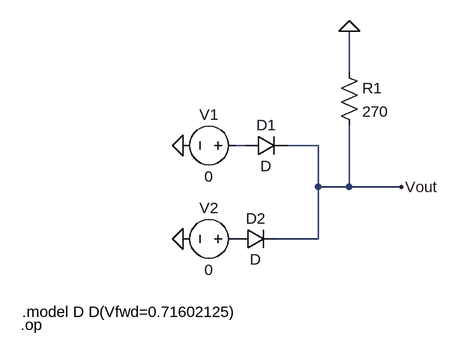
[diagram p0: schematic D3-DÇ4.asc]
D3-DÇ4.asc, the LTspice schematic file:
Version 4
SHEET 1 880 680
WIRE 288 -16 288 -80
WIRE 128 96 112 96
WIRE 240 96 192 96
WIRE 240 160 240 96
WIRE 288 160 288 64
WIRE 288 160 240 160
WIRE 368 160 288 160
WIRE 240 240 240 160
WIRE 240 240 176 240
FLAG 368 160 Vout
FLAG 32 96 0
FLAG 32 240 0
FLAG 288 -80 0
SYMBOL res 272 -32 R0
SYMATTR InstName R1
SYMATTR Value 270
SYMBOL voltage 128 96 R90
WINDOW 0 -32 56 VBottom 2
WINDOW 3 32 56 VTop 2
WINDOW 123 0 0 Left 0
WINDOW 39 0 0 Left 0
SYMATTR InstName V1
SYMATTR Value 0
SYMBOL voltage 128 240 R90
WINDOW 0 -32 56 VBottom 2
WINDOW 3 32 56 VTop 2
WINDOW 123 0 0 Left 0
WINDOW 39 0 0 Left 0
SYMATTR InstName V2
SYMATTR Value 0
SYMBOL diode 128 112 R270
WINDOW 0 32 32 VTop 2
WINDOW 3 0 32 VBottom 2
SYMATTR InstName D1
SYMBOL diode 112 256 R270
WINDOW 0 32 32 VTop 2
WINDOW 3 0 32 VBottom 2
SYMATTR InstName D2
TEXT -216 352 Left 2 !.model D D(Vfwd=0.71602125)
TEXT -218 372 Left 2 !.op

The netlist it stands for:
* D3-DÇ4.asc
R1 0 Vout 270
V1 N001 0 0
V2 P001 0 0
D1 N001 Vout D
D2 P001 Vout D
.model D D
.lib standard.dio
.model D D(Vfwd=0.71602125)
.op
.backanno
.end